# EAGLE design PowerDissBoard (EAGLE 7.6.0)
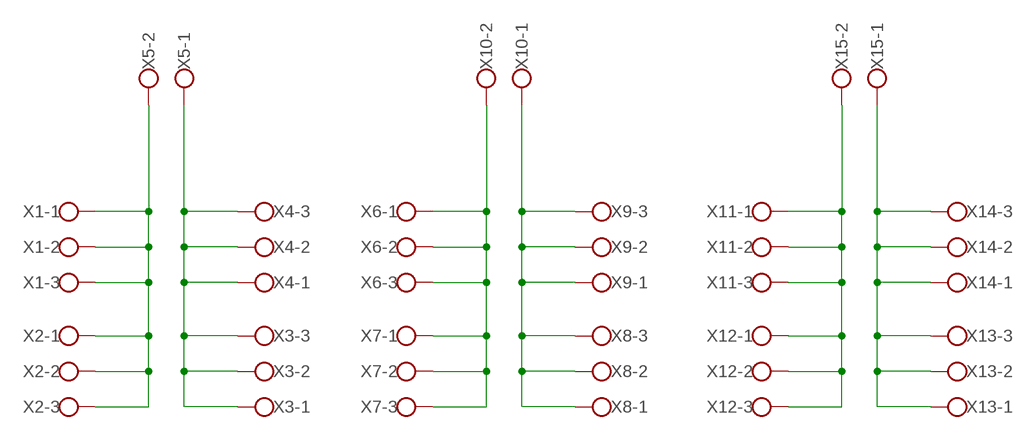
[diagram p0: schematic, sheet 1]

## Parts
X1  W237-103  [W237-103]
X2  W237-103  [W237-103]
X3  W237-103  [W237-103]
X4  W237-103  [W237-103]
X5  W237-102  [W237-102]
X6  W237-103  [W237-103]
X7  W237-103  [W237-103]
X8  W237-103  [W237-103]
X9  W237-103  [W237-103]
X10  W237-102  [W237-102]
X11  W237-103  [W237-103]
X12  W237-103  [W237-103]
X13  W237-103  [W237-103]
X14  W237-103  [W237-103]
X15  W237-102  [W237-102]

## Nets
N$1: X1.1 X1.2 X1.3 X2.1 X2.2 X2.3 X5.2
N$2: X3.1 X3.2 X3.3 X4.1 X4.2 X4.3 X5.1
N$3: X6.1 X6.2 X6.3 X7.1 X7.2 X7.3 X10.2
N$4: X8.1 X8.2 X8.3 X9.1 X9.2 X9.3 X10.1
N$6: X11.1 X11.2 X11.3 X12.1 X12.2 X12.3 X15.2
N$7: X13.1 X13.2 X13.3 X14.1 X14.2 X14.3 X15.1

## Library data of the parts
X1-X4 X6-X9 X11-X14 = con-wago-500:W237-103: WAGO SCREW CLAMP; MPN: 237-103; OC_FARNELL: unknown; OC_NEWARK: 18M7116
X5 X10 X15 = con-wago-500:W237-102: WAGO SCREW CLAMP; MPN: 237-102; OC_FARNELL: unknown; OC_NEWARK: 70K9898

## Board
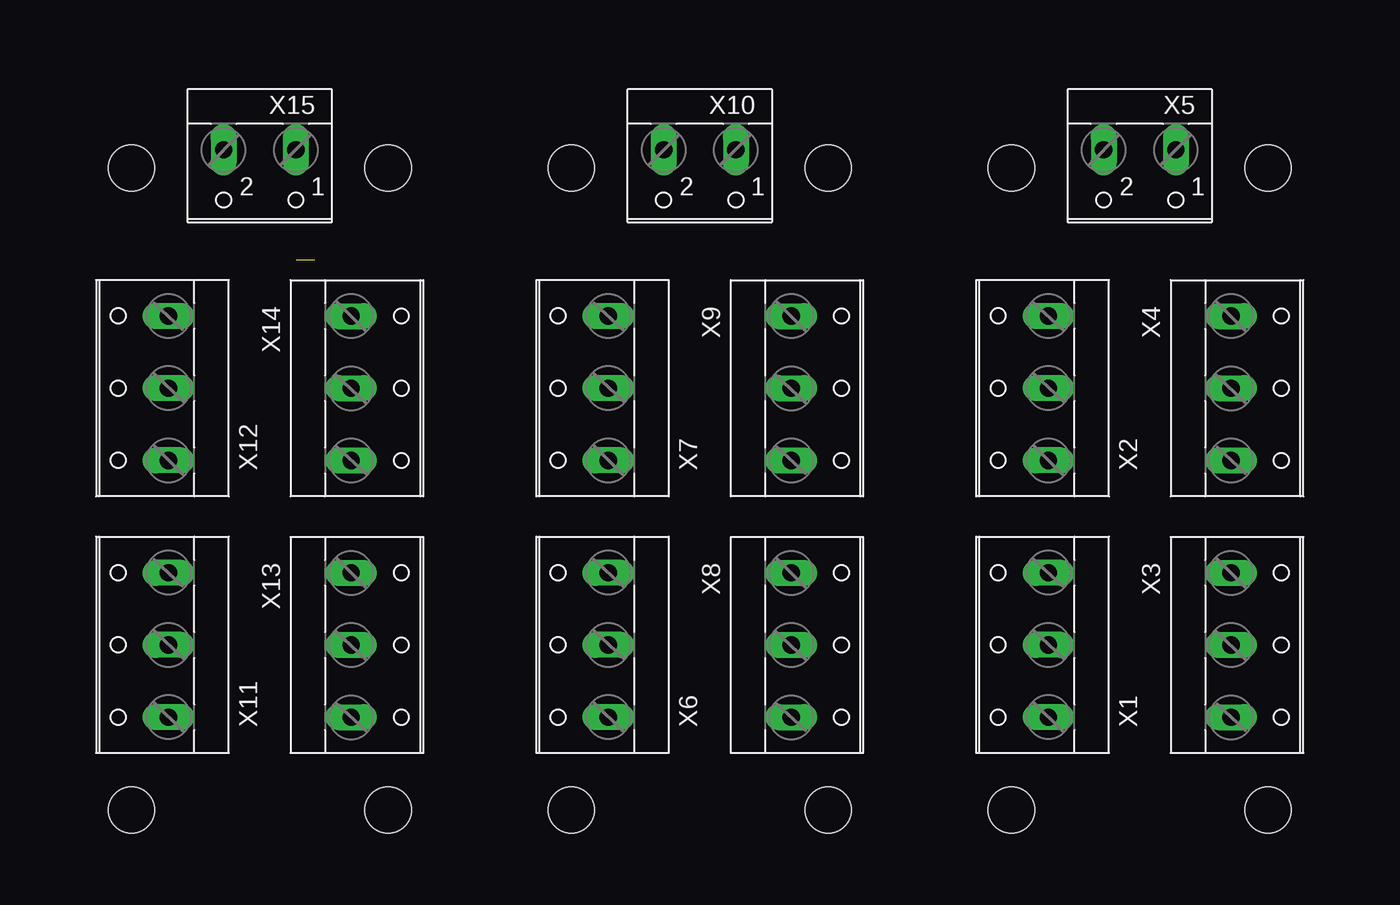
[diagram p1: board, top side]
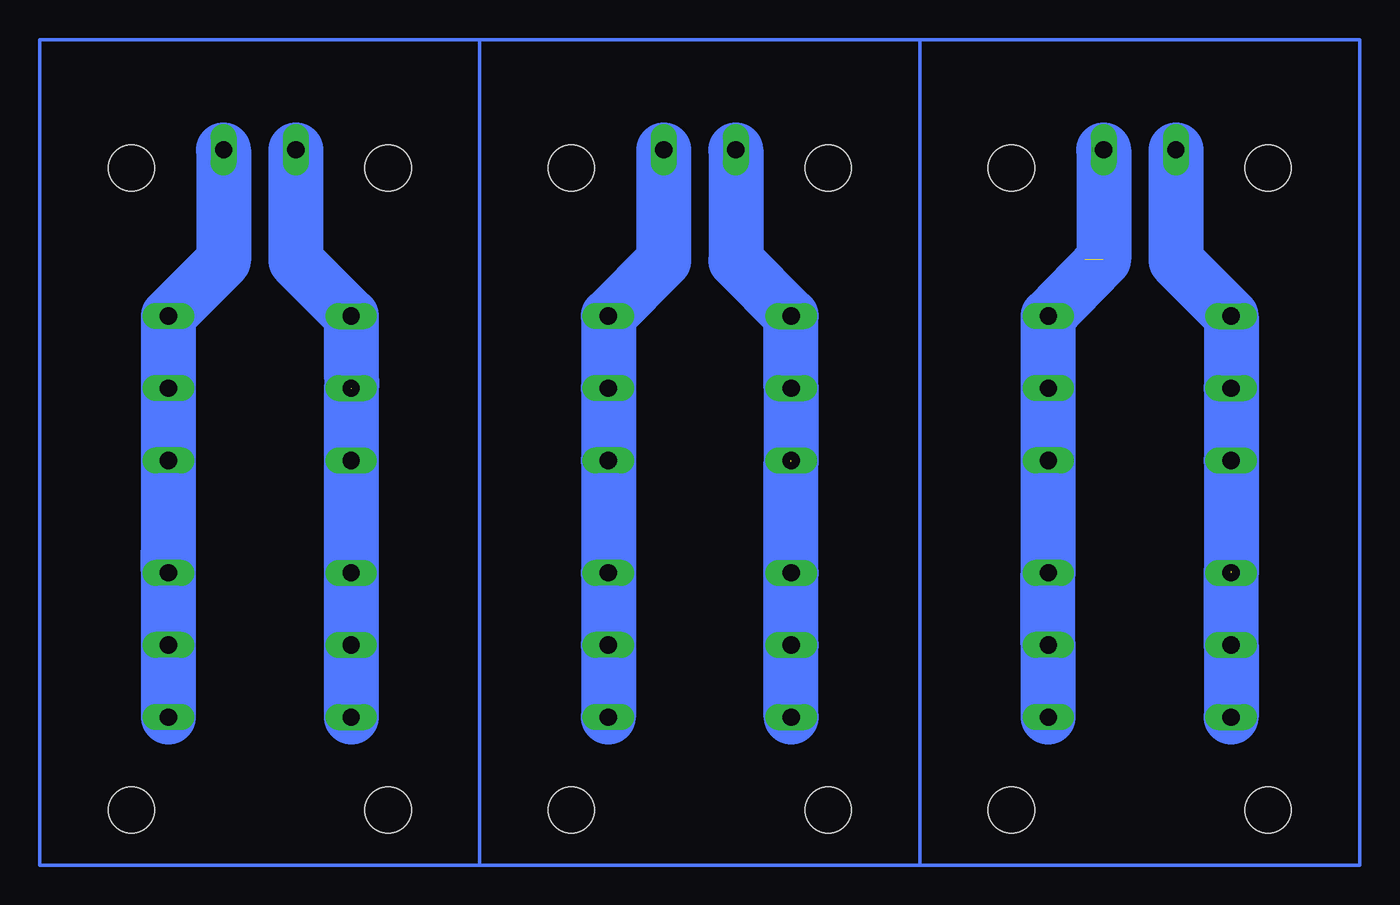
[diagram p2: board, bottom side, seen from below]

No outline drawn. Coordinates in mm, seen from the top.
Copper layers (1*16): Top 0.035mm / dielectric 1.5mm / Bottom 0.035mm
Design rules "default": minimum track width 10mil, minimum drill 24mil, track to track 8mil, track to pad 8mil, pad to pad 8mil, via to via 8mil, smd to smd 8mil, copper to edge 40mil, drill to drill 8mil, minimum pad ring 10mil, minimum via ring 8mil, stop-mask expansion 4mil, vias tented up to drill 0mil, thermal gap 10mil
Holes 3.2 mm at 86.36,5.08 68.58,5.08 68.58,49.53 86.36,49.53 38.1,5.08 55.88,5.08 55.88,49.53 38.1,49.53 7.62,5.08 25.4,5.08 25.4,49.53 7.62,49.53

### Footprints (pad centres in the part's own frame; a part is rotated, then mirrored left to right if it is on the bottom)
W237-103 = drill 1.194 long: 1 -5,-1.29; 2 0,-1.29; 3 5,-1.29
W237-102 = drill 1.194 long: 1 -2.5,-1.27; 2 2.5,-1.27

### Placement (x,y rotation side)
X1  69.85,16.51 90 top
X2  69.85,34.29 90 top
X3  85.09,16.51 270 top
X4  85.09,34.29 270 top
X5  77.47,49.53 180 top
X6  39.37,16.51 90 top
X7  39.37,34.29 90 top
X8  54.61,16.51 270 top
X9  54.61,34.29 270 top
X10  46.99,49.53 180 top
X11  8.89,16.51 90 top
X12  8.89,34.29 90 top
X13  24.13,16.51 270 top
X14  24.13,34.29 270 top
X15  16.51,49.53 180 top

### Tracks (layer width: path | path; a pad name or v marks a point on that pad's centre or on a via)
N$1  (1 unrouted)
  Bottom 3.81: 71.12,34.29 71.14,35.58 X2.3 74.97,43.12 X5.2 | X2.2 X2.1 X1.3 X1.2 X1.1
N$2
  Bottom 3.81: X3.3 X3.2 X3.1 83.82,22.8 83.82,22.86 83.8,21.61 X4.3 X4.2 X4.1 79.97,43.12 X5.1
N$3  (1 unrouted)
  Bottom 3.81: X6.1 X6.2 X6.3 40.66,29.19 40.64,29.21 | X7.1 X7.2 X7.3 44.49,43.12 X10.2
N$4
  Bottom 3.81: X10.1 49.49,43.12 X9.1 X9.2 X9.3 X8.1 X8.2 X8.3
N$5
  Bottom 0.254: 62.23,1.27 92.71,1.27 92.71,58.42 62.23,58.42 | 62.23,1.27 31.75,1.27 | 31.75,1.27 31.75,58.42 | 31.75,58.42 62.23,58.42 | 62.23,1.27 62.23,58.42 | 31.75,1.27 1.27,1.27 1.27,58.42 31.75,58.42
N$6  (1 unrouted)
  Bottom 3.81: X15.2 14.01,43.12 X12.3 X12.2 X12.1 10.18,21.61 10.16,21.59 | X11.3 X11.2 X11.1
N$7  (2 unrouted)
  Bottom 3.81: X13.3 X13.2 22.86,16.51 22.86,21.49 X13.1 X14.3 X14.2 X14.1 19.03,43.2 | X15.1 19.01,43.22 19.03,43.2 | 19.03,43.2 19.05,43.18